# Altium schematic sheet MIXER.SchDoc (part 1 of 2)
size Letter; DrawnBy: Titan Yuan; SheetNumber: 3; SheetTotal: 8
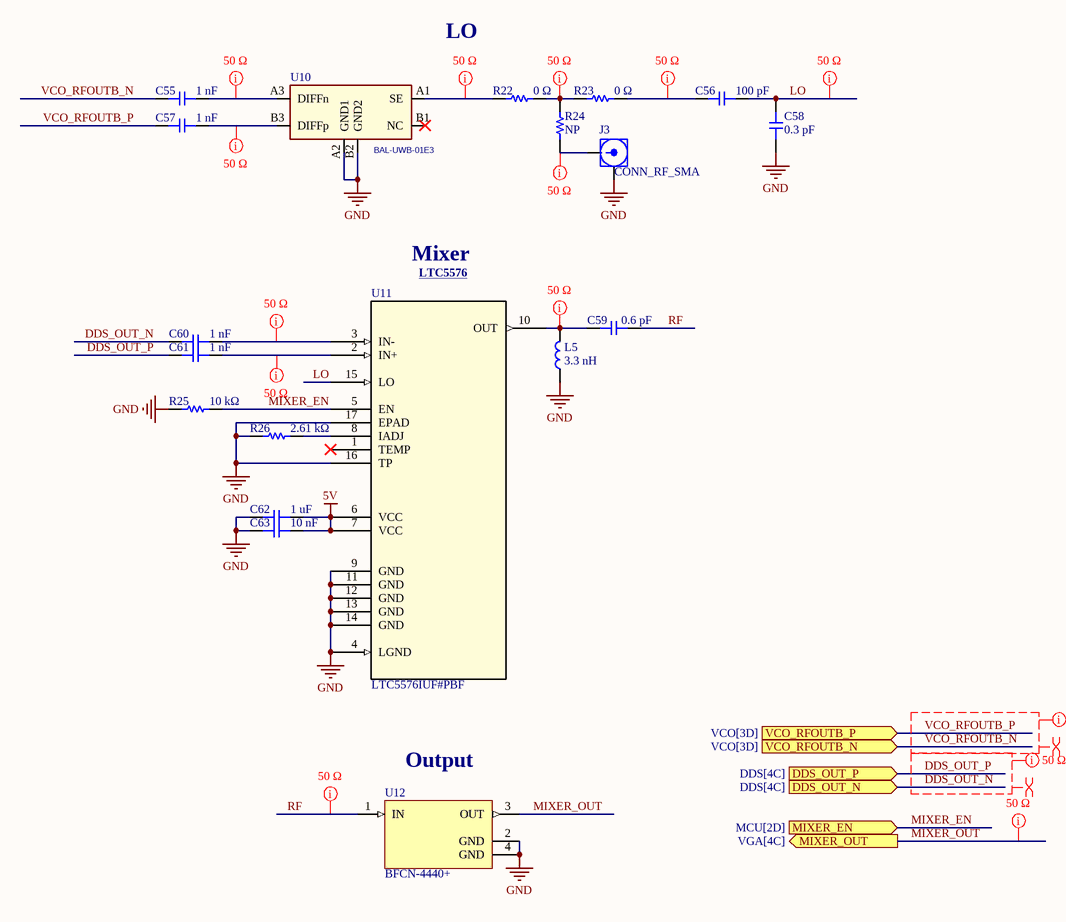
[diagram p0: MIXER.SchDoc]

## Parts
C55  1 nF  [CAP_0402]
C56  100 pF  [CAP_0402]
C57  1 nF  [CAP_0402]
C58  0.3 pF  [CAP_0402]
C59  0.6 pF  [CAP_0402]
C60  1 nF  [CAP_0402]
C61  1 nF  [CAP_0402]
C62  1 uF  [CAP_0603]
C63  10 nF  [CAP_0402]
J3  CONN_RF_SMA  [142-0701-801]
L5  3.3 nH  [IND_0402]
R22  0 Ω  [RES_0402]
R23  0 Ω  [RES_0402]
R24  NP  [RES_0402]
R25  10 kΩ  [RES_0402]
R26  2.61 kΩ  [RES_0402]
U10  BAL-UWB-01E3  [ST_CSP6_82x65P2x3_180x125x45]
U11  LTC5576IUF#PBF  [QFN-16_UF_LIT]
U12  BFCN-4440+  [FV1206]

## Ports
DDS_OUT_N (in, see DDS[4C]), DDS_OUT_P (in, see DDS[4C]), MIXER_EN (in, see MCU[2D]), MIXER_OUT (out, see VGA[4C]), VCO_RFOUTB_N (in, see VCO[3D]), VCO_RFOUTB_P (in, see VCO[3D])

## Nets
5V: C62.2 C63.2 U11.6(VCC) U11.7(VCC)
GND: C58.1 C62.1 C63.1 J3.2 L5.1 R25.1 R26.1 U10.A2(GND1) U10.B2(GND2) U11.4(LGND) U11.9(GND) U11.11(GND) U11.12(GND) U11.13(GND) U11.14(GND) U11.16(TP) U11.17(EPAD) U12.2(GND) U12.4(GND)
DDS_OUT_N: C60.1 ; port DDS_OUT_N
DDS_OUT_P: C61.1 ; port DDS_OUT_P
LO: C56.2 C58.2 U11.15(LO)
MIXER_EN: R25.2 U11.5(EN) ; port MIXER_EN
MIXER_OUT: U12.3(OUT) ; port MIXER_OUT
RF: C59.2 U12.1(IN)
VCO_RFOUTB_N: C55.2 ; port VCO_RFOUTB_N
VCO_RFOUTB_P: C57.2 ; port VCO_RFOUTB_P
NetC55_1: C55.1 U10.A3(DIFFn)
NetC56_1: C56.1 R23.2
NetC57_1: C57.1 U10.B3(DIFFp)
NetC59_1: C59.1 L5.2 U11.10(OUT)
NetC60_2: C60.2 U11.3(IN-)
NetC61_2: C61.2 U11.2(IN+)
NetJ3_1: J3.1 R24.1
NetR22_1: R22.1 U10.A1(SE)
NetR22_2: R22.2 R23.1 R24.2
NetR26_2: R26.2 U11.8(IADJ)

Not connected (* = marked no-connect by the designer): U10 B1(NC)*; U11 1(TEMP)*

## Layout directives
differential pair: DDS_OUT_N, DDS_OUT_P, VCO_RFOUTB_N, VCO_RFOUTB_P
net class 50 Ω: DDS_OUT_N, DDS_OUT_P, LO, MIXER_OUT, NetC55_1, NetC56_1, NetC57_1, NetC59_1, NetC60_2, NetC61_2, NetJ3_1, NetR22_1, NetR22_2, RF, VCO_RFOUTB_N, VCO_RFOUTB_P

## Notes on the sheet
- LO
- Mixer
- (near U11) LTC5576 <https://www.analog.com/en/products/ltc5576.html>
- (near U12) Output
## Library data of the parts
C55 C57 C60 C61 = CAP: 50V 1nF X7R ±10% 0402 Multilayer Ceramic Capacitors MLCC - SMD/SMT ROHS; Manufacturer: Yageo; Manufacturer Part Number: CC0402KRX7R9BB102; Tolerance: +-10%; Insulation Resistance: 100GΩ; Temperature Coefficient: 30ppm/°C; Voltage Rating: 50 V; Dielectric: Ceramic; Package Size: 0402; Supplier: DigiKey; Supplier Part Number: 311-1036-1-ND; RoHS: Compliant; Category: Ceramic Capacitors; Stock: 3090255; Pricing: 1=0.08, 10=0.004 (USD); Value: 1nF; Case/Package: 0402; Case Code (Imperial): 0402; Case Code (Metric): 1005; China RoHS: Compliant; Composition: Ceramic; Country of Origin: Mainland China, Taiwan; Depth: 500µm; Dielectric Material: Ceramic; Export Control Classification Number (ECCN) Code: EAR99; Halogen Free: Halogen Free; Height: 500µm; Harmonized Tariff Schedule (HTS) Code: 8532.24.00.20; Introduction Date: 2003-01-27; Lead Free: Lead Free; Length: 1mm; Lifecycle Status: Production; Material: Ceramic; Max Operating Temperature: 125°C; Min Operating Temperature: -55°C; Mounting Technology: Surface Mount; Pins: 2; Number of Terminals: 2; Radiation Hardening: No; REACH SVHC: Yes; Schedule B: 8532240020, 8532240020|8532240020|8532240020|8532240020|8532240020|8532240020|8532240020|8532240020|8532240020|8532240020|8532240020|8532240020|8532240020|8532240020|8532240020|8532240020|8532240020|8532240020|8532240020|8532240020|8532240020|8532240020|8532240020|85; Termination: SMD/SMT; Thickness: 558.8µm; Voltage: 50V; Voltage Rating (AC): 50V; Voltage Rating (DC): 50V; Width: 500µm; ComponentLink1URL: https://datasheet.octopart.com:443/CC0402KRX7R9BB102-Yageo-datasheet-177165144.pdf?src-supplier=IHS; ComponentLink1Description: https://datasheet.octopart.com:443/CC0402KRX7R9BB102-Yageo-datasheet-177165144.pdf?src-supplier=IHS; ComponentLink2URL: https://datasheet.octopart.com:443/CC0402KRX7R9BB102-Yageo-datasheet-82288757.pdf?src-supplier=Upverter; ComponentLink2Description: https://datasheet.octopart.com:443/CC0402KRX7R9BB102-Yageo-datasheet-82288757.pdf?src-supplier=Upverter; ComponentLink3URL: https://datasheet.octopart.com:443/CC0402KRX7R9BB102-Yageo-datasheet-78855684.pdf?src-supplier=Upverter; ComponentLink3Description: https://datasheet.octopart.com:443/CC0402KRX7R9BB102-Yageo-datasheet-78855684.pdf?src-supplier=Upverter; ComponentLink4URL: https://datasheet.octopart.com/CC0402KRX7R9BB102-Yageo-datasheet-10883670.pdf; ComponentLink4Description: https://datasheet.octopart.com/CC0402KRX7R9BB102-Yageo-datasheet-10883670.pdf; ComponentLink5URL: https://datasheet.octopart.com:443/CC0402KRX7R9BB102-Yageo-datasheet-147453679.pdf?src-supplier=Farnell; ComponentLink5Description: https://datasheet.octopart.com:443/CC0402KRX7R9BB102-Yageo-datasheet-147453679.pdf?src-supplier=Farnell; ComponentLink6URL: https://datasheet.octopart.com:443/CC0402KRX7R9BB102-Yageo-datasheet-151948686.pdf?src-supplier=Farnell; ComponentLink6Description: https://datasheet.octopart.com:443/CC0402KRX7R9BB102-Yageo-datasheet-151948686.pdf?src-supplier=Farnell; ComponentLink7URL: https://datasheet.octopart.com:443/CC0402KRX7R9BB102-Phycomp-datasheet-500777.pdf?src-supplier=Farnell; ComponentLink7Description: https://datasheet.octopart.com:443/CC0402KRX7R9BB102-Phycomp-datasheet-500777.pdf?src-supplier=Farnell; ComponentLink8URL: https://datasheet.octopart.com:443/CC0402KRX7R9BB102-Yageo-datasheet-5301394.pdf?src-supplier=Newark; ComponentLink8Description: https://datasheet.octopart.com:443/CC0402KRX7R9BB102-Yageo-datasheet-5301394.pdf?src-supplier=Newark; ComponentLink9URL: https://datasheet.octopart.com:443/CC0402KRX7R9BB102-Yageo-datasheet-62336348.pdf?src-supplier=Newark; ComponentLink9Description: https://datasheet.octopart.com:443/CC0402KRX7R9BB102-Yageo-datasheet-62336348.pdf?src-supplier=Newark; ComponentLink10URL: https://datasheet.octopart.com:443/CC0402KRX7R9BB102-Yageo-datasheet-182878162.pdf?src-supplier=Newark; ComponentLink10Description: https://datasheet.octopart.com:443/CC0402KRX7R9BB102-Yageo-datasheet-182878162.pdf?src-supplier=Newark; ComponentLink11URL: https://datasheet.octopart.com:443/CC0402KRX7R9BB102-Phycomp-datasheet-499490.pdf?src-supplier=element14; ComponentLink11Description: https://datasheet.octopart.com:443/CC0402KRX7R9BB102-Phycomp-datasheet-499490.pdf?src-supplier=element14; ComponentLink12URL: https://datasheet.octopart.com:443/CC0402KRX7R9BB102-Yageo-datasheet-8701427.pdf?src-supplier=element14; ComponentLink12Description: https://datasheet.octopart.com:443/CC0402KRX7R9BB102-Yageo-datasheet-8701427.pdf?src-supplier=element14; ComponentLink13URL: https://datasheet.octopart.com:443/CC0402KRX7R9BB102-Yageo-datasheet-166511530.pdf?src-supplier=Future+Electronics; ComponentLink13Description: https://datasheet.octopart.com:443/CC0402KRX7R9BB102-Yageo-datasheet-166511530.pdf?src-supplier=Future+Electronics; ComponentLink14URL: https://datasheet.octopart.com:443/CC0402KRX7R9BB102-Yageo-datasheet-137700082.pdf?src-supplier=Future+Electronics; ComponentLink14Description: https://datasheet.octopart.com:443/CC0402KRX7R9BB102-Yageo-datasheet-137700082.pdf?src-supplier=Future+Electronics; ComponentLink15URL: https://datasheet.octopart.com:443/CC0402KRX7R9BB102-Yageo-datasheet-137700084.pdf?src-supplier=Future+Electronics; ComponentLink15Description: https://datasheet.octopart.com:443/CC0402KRX7R9BB102-Yageo-datasheet-137700084.pdf?src-supplier=Future+Electronics; ComponentLink16URL: https://datasheet.octopart.com:443/CC0402KRX7R9BB102-Yageo-datasheet-78855685.pdf?src-supplier=Future+Electronics; ComponentLink16Description: https://datasheet.octopart.com:443/CC0402KRX7R9BB102-Yageo-datasheet-78855685.pdf?src-supplier=Future+Electronics; ComponentLink17URL: https://datasheet.octopart.com:443/CC0402KRX7R9BB102-Yageo-datasheet-27626582.pdf?src-supplier=Future+Electronics; ComponentLink17Description: https://datasheet.octopart.com:443/CC0402KRX7R9BB102-Yageo-datasheet-27626582.pdf?src-supplier=Future+Electronics; ComponentLink18URL: https://datasheet.octopart.com:443/CC0402KRX7R9BB102-Yageo-datasheet-24578986.pdf?src-supplier=Future+Electronics; ComponentLink18Description: https://datasheet.octopart.com:443/CC0402KRX7R9BB102-Yageo-datasheet-24578986.pdf?src-supplier=Future+Electronics; ComponentLink19URL: https://datasheet.octopart.com:443/CC0402KRX7R9BB102-Yageo-datasheet-15895757.pdf?src-supplier=Future+Electronics; ComponentLink19Description: https://datasheet.octopart.com:443/CC0402KRX7R9BB102-Yageo-datasheet-15895757.pdf?src-supplier=Future+Electronics; ComponentLink20URL: https://datasheet.octopart.com:443/CC0402KRX7R9BB102-Yageo-datasheet-12526321.pdf?src-supplier=Future+Electronics; ComponentLink20Description: https://datasheet.octopart.com:443/CC0402KRX7R9BB102-Yageo-datasheet-12526321.pdf?src-supplier=Future+Electronics; ComponentLink21URL: https://datasheet.octopart.com:443/CC0402KRX7R9BB102-Yageo-datasheet-8324192.pdf?src-supplier=Future+Electronics; ComponentLink21Description: https://datasheet.octopart.com:443/CC0402KRX7R9BB102-Yageo-datasheet-8324192.pdf?src-supplier=Future+Electronics; ComponentLink22URL: https://datasheet.octopart.com:443/CC0402KRX7R9BB102-Yageo-datasheet-68298032.pdf?src-supplier=Future+Electronics; ComponentLink22Description: https://datasheet.octopart.com:443/CC0402KRX7R9BB102-Yageo-datasheet-68298032.pdf?src-supplier=Future+Electronics; ComponentLink23URL: https://datasheet.octopart.com:443/CC0402KRX7R9BB102-Yageo-datasheet-178018854.pdf?src-supplier=Burklin+Elektronik; ComponentLink23Description: https://datasheet.octopart.com:443/CC0402KRX7R9BB102-Yageo-datasheet-178018854.pdf?src-supplier=Burklin+Elektronik; ComponentLink24URL: https://datasheet.octopart.com:443/CC0402KRX7R9BB102-Yageo-Group-datasheet-165992755.pdf?src-supplier=ODG+(Origin+Data+Global); ComponentLink24Description: https://datasheet.octopart.com:443/CC0402KRX7R9BB102-Yageo-Group-datasheet-165992755.pdf?src-supplier=ODG+(Origin+Data+Global); ComponentLink25URL: https://datasheet.octopart.com:443/CC0402KRX7R9BB102-Yageo-datasheet-120101875.pdf?src-supplier=Megastar; ComponentLink25Description: https://datasheet.octopart.com:443/CC0402KRX7R9BB102-Yageo-datasheet-120101875.pdf?src-supplier=Megastar; ComponentLink26URL: https://datasheet.octopart.com:443/CC0402KRX7R9BB102-Yageo-datasheet-118396.pdf?src-supplier=DigiKey; ComponentLink26Description: https://datasheet.octopart.com:443/CC0402KRX7R9BB102-Yageo-datasheet-118396.pdf?src-supplier=DigiKey; ComponentLink27URL: http://sigma.octopart.com:80/conflict_mineral_statement/Yageo-company-3.pdf?src-supplier=Compliance+Statements; ComponentLink27Description: http://sigma.octopart.com:80/conflict_mineral_statement/Yageo-company-3.pdf?src-supplier=Compliance+Statements; ComponentLink28URL: http://sigma.octopart.com:80/rohs_statement/Yageo-company-2.pdf?src-supplier=Compliance+Statements; ComponentLink28Description: http://sigma.octopart.com:80/rohs_statement/Yageo-company-2.pdf?src-supplier=Compliance+Statements
C56 = CAP: 50V 100pF NP0 ±5% 0402 Multilayer Ceramic Capacitors MLCC - SMD/SMT ROHS; Manufacturer: Yageo; Manufacturer Part Number: CC0402JRNPO9BN101; Tolerance: +-5%; Insulation Resistance: 100GΩ; Temperature Coefficient: 30ppm/°C; Voltage Rating: 50 V; Dielectric: Ceramic; Package Size: 0402; Supplier: DigiKey; Supplier Part Number: 311-1024-1-ND; RoHS: Compliant; Category: Ceramic Capacitors; Stock: 3080901; Pricing: 1=0.08, 10=0.003, 10000=0.0032, 20000=0.0031, 30000=0.00304, 50000=0.00283, 70000=0.00282 (USD); Value: 100pF; Case/Package: 0402; Case Code (Imperial): 0402; Case Code (Metric): 1005; China RoHS: Compliant; Composition: Ceramic; Depth: 500µm; Dielectric Material: Ceramic; Halogen Free: Halogen Free; Height: 500µm; Lead Free: Lead Free; Length: 1mm; Lifecycle Status: Production; Max Operating Temperature: 125°C; Min Operating Temperature: -55°C; Mounting Technology: Surface Mount; Pins: 2; Number of Terminals: 2; Radiation Hardening: No; REACH SVHC: Yes; Schedule B: 8532240020, 8532240020|8532240020|8532240020|8532240020|8532240020|8532240020|8532240020|8532240020|8532240020|8532240020|8532240020|8532240020|8532240020|8532240020|8532240020|8532240020|8532240020|8532240020|8532240020|8532240020|8532240020|8532240020|8532240020|85; Termination: SMD/SMT; Thickness: 558.8µm; Voltage: 50V; Voltage Rating (AC): 50V; Voltage Rating (DC): 50V; Width: 500µm; ComponentLink1URL: https://datasheet.octopart.com:443/CC0402JRNPO9BN101-Yageo-datasheet-182140217.pdf?src-supplier=IHS; ComponentLink1Description: https://datasheet.octopart.com:443/CC0402JRNPO9BN101-Yageo-datasheet-182140217.pdf?src-supplier=IHS; ComponentLink2URL: https://datasheet.octopart.com:443/CC0402JRNPO9BN101-Yageo-datasheet-10406438.pdf?src-supplier=element14+APAC; ComponentLink2Description: https://datasheet.octopart.com:443/CC0402JRNPO9BN101-Yageo-datasheet-10406438.pdf?src-supplier=element14+APAC; ComponentLink3URL: https://datasheet.octopart.com:443/CC0402JRNPO9BN101-Yageo-datasheet-151948684.pdf?src-supplier=element14+APAC; ComponentLink3Description: https://datasheet.octopart.com:443/CC0402JRNPO9BN101-Yageo-datasheet-151948684.pdf?src-supplier=element14+APAC; ComponentLink4URL: https://datasheet.octopart.com:443/CC0402JRNPO9BN101-Yageo-datasheet-67645495.pdf?src-supplier=element14+APAC; ComponentLink4Description: https://datasheet.octopart.com:443/CC0402JRNPO9BN101-Yageo-datasheet-67645495.pdf?src-supplier=element14+APAC; ComponentLink5URL: https://datasheet.octopart.com:443/CC0402JRNPO9BN101-Yageo-datasheet-10882999.pdf?src-supplier=element14+APAC; ComponentLink5Description: https://datasheet.octopart.com:443/CC0402JRNPO9BN101-Yageo-datasheet-10882999.pdf?src-supplier=element14+APAC; ComponentLink6URL: https://datasheet.octopart.com:443/CC0402JRNPO9BN101-Yageo-datasheet-78855684.pdf?src-supplier=Upverter; ComponentLink6Description: https://datasheet.octopart.com:443/CC0402JRNPO9BN101-Yageo-datasheet-78855684.pdf?src-supplier=Upverter; ComponentLink7URL: https://datasheet.octopart.com:443/CC0402JRNPO9BN101-Yageo-Group-datasheet-188689597.pdf?src-supplier=Farnell; ComponentLink7Description: https://datasheet.octopart.com:443/CC0402JRNPO9BN101-Yageo-Group-datasheet-188689597.pdf?src-supplier=Farnell; ComponentLink8URL: https://datasheet.octopart.com:443/CC0402JRNPO9BN101-Yageo-datasheet-10621397.pdf?src-supplier=Farnell; ComponentLink8Description: https://datasheet.octopart.com:443/CC0402JRNPO9BN101-Yageo-datasheet-10621397.pdf?src-supplier=Farnell; ComponentLink9URL: https://datasheet.octopart.com:443/CC0402JRNPO9BN101-Yageo-datasheet-65873193.pdf?src-supplier=Newark; ComponentLink9Description: https://datasheet.octopart.com:443/CC0402JRNPO9BN101-Yageo-datasheet-65873193.pdf?src-supplier=Newark; ComponentLink10URL: https://datasheet.octopart.com:443/CC0402JRNPO9BN101-Yageo-datasheet-5301394.pdf?src-supplier=Newark; ComponentLink10Description: https://datasheet.octopart.com:443/CC0402JRNPO9BN101-Yageo-datasheet-5301394.pdf?src-supplier=Newark; ComponentLink11URL: https://datasheet.octopart.com:443/CC0402JRNPO9BN101-Yageo-datasheet-182966517.pdf?src-supplier=Newark; ComponentLink11Description: https://datasheet.octopart.com:443/CC0402JRNPO9BN101-Yageo-datasheet-182966517.pdf?src-supplier=Newark; ComponentLink12URL: https://datasheet.octopart.com:443/CC0402JRNPO9BN101-Yageo-datasheet-137875056.pdf?src-supplier=Future+Electronics; ComponentLink12Description: https://datasheet.octopart.com:443/CC0402JRNPO9BN101-Yageo-datasheet-137875056.pdf?src-supplier=Future+Electronics; ComponentLink13URL: https://datasheet.octopart.com:443/CC0402JRNPO9BN101-Yageo-datasheet-136957424.pdf?src-supplier=Future+Electronics; ComponentLink13Description: https://datasheet.octopart.com:443/CC0402JRNPO9BN101-Yageo-datasheet-136957424.pdf?src-supplier=Future+Electronics; ComponentLink14URL: https://datasheet.octopart.com:443/CC0402JRNPO9BN101-Yageo-datasheet-137700082.pdf?src-supplier=Future+Electronics; ComponentLink14Description: https://datasheet.octopart.com:443/CC0402JRNPO9BN101-Yageo-datasheet-137700082.pdf?src-supplier=Future+Electronics; ComponentLink15URL: https://datasheet.octopart.com:443/CC0402JRNPO9BN101-Yageo-datasheet-62126864.pdf?src-supplier=Future+Electronics; ComponentLink15Description: https://datasheet.octopart.com:443/CC0402JRNPO9BN101-Yageo-datasheet-62126864.pdf?src-supplier=Future+Electronics; ComponentLink16URL: https://datasheet.octopart.com:443/CC0402JRNPO9BN101-Yageo-datasheet-62091628.pdf?src-supplier=Future+Electronics; ComponentLink16Description: https://datasheet.octopart.com:443/CC0402JRNPO9BN101-Yageo-datasheet-62091628.pdf?src-supplier=Future+Electronics; ComponentLink17URL: https://datasheet.octopart.com:443/CC0402JRNPO9BN101-Yageo-datasheet-24578986.pdf?src-supplier=Future+Electronics; ComponentLink17Description: https://datasheet.octopart.com:443/CC0402JRNPO9BN101-Yageo-datasheet-24578986.pdf?src-supplier=Future+Electronics; ComponentLink18URL: https://datasheet.octopart.com:443/CC0402JRNPO9BN101-Yageo-datasheet-16730043.pdf?src-supplier=Future+Electronics; ComponentLink18Description: https://datasheet.octopart.com:443/CC0402JRNPO9BN101-Yageo-datasheet-16730043.pdf?src-supplier=Future+Electronics; ComponentLink19URL: https://datasheet.octopart.com:443/CC0402JRNPO9BN101-Yageo-datasheet-12589826.pdf?src-supplier=Future+Electronics; ComponentLink19Description: https://datasheet.octopart.com:443/CC0402JRNPO9BN101-Yageo-datasheet-12589826.pdf?src-supplier=Future+Electronics; ComponentLink20URL: https://datasheet.octopart.com:443/CC0402JRNPO9BN101-Yageo-datasheet-8817079.pdf?src-supplier=element14; ComponentLink20Description: https://datasheet.octopart.com:443/CC0402JRNPO9BN101-Yageo-datasheet-8817079.pdf?src-supplier=element14; ComponentLink21URL: https://datasheet.octopart.com:443/CC0402JRNPO9BN101-Yageo-datasheet-8324240.pdf?src-supplier=element14; ComponentLink21Description: https://datasheet.octopart.com:443/CC0402JRNPO9BN101-Yageo-datasheet-8324240.pdf?src-supplier=element14; ComponentLink22URL: https://datasheet.octopart.com:443/CC0402JRNPO9BN101-Yageo-datasheet-504625.pdf?src-supplier=element14; ComponentLink22Description: https://datasheet.octopart.com:443/CC0402JRNPO9BN101-Yageo-datasheet-504625.pdf?src-supplier=element14; ComponentLink23URL: https://datasheet.octopart.com:443/CC0402JRNPO9BN101-Yageo-datasheet-5321569.pdf?src-supplier=element14; ComponentLink23Description: https://datasheet.octopart.com:443/CC0402JRNPO9BN101-Yageo-datasheet-5321569.pdf?src-supplier=element14; ComponentLink24URL: https://datasheet.octopart.com:443/CC0402JRNPO9BN101-Yageo-datasheet-68296204.pdf?src-supplier=Megastar; ComponentLink24Description: https://datasheet.octopart.com:443/CC0402JRNPO9BN101-Yageo-datasheet-68296204.pdf?src-supplier=Megastar; ComponentLink25URL: http://sigma.octopart.com:80/conflict_mineral_statement/Yageo-company-3.pdf?src-supplier=Compliance+Statements; ComponentLink25Description: http://sigma.octopart.com:80/conflict_mineral_statement/Yageo-company-3.pdf?src-supplier=Compliance+Statements; ComponentLink26URL: http://sigma.octopart.com:80/rohs_statement/Yageo-company-2.pdf?src-supplier=Compliance+Statements; ComponentLink26Description: http://sigma.octopart.com:80/rohs_statement/Yageo-company-2.pdf?src-supplier=Compliance+Statements
C58 = CAP: 50V 0.3pF C0G 0402 Multilayer Ceramic Capacitors MLCC - SMD/SMT ROHS; Manufacturer: Murata Electronics; Manufacturer Part Number: GJM1555C1HR30WB01D; Manufacturer Lifecycle Status: IN PRODUCTION; Tolerance: +-0.05 pF; Value: 300fF; Temperature Coefficient: 30ppm/°C; Voltage Rating: 50 V; Dielectric: Ceramic; Package Size: 0402; Dielectric Material: Ceramic; Supplier: DigiKey; Supplier Part Number: 490-11248-1-ND; RoHS: Compliant; Category: Ceramic Capacitors; Stock: 220310; Pricing: 1=0.14, 10=0.076, 50=0.0532, 100=0.0462, 500=0.0344, 1000=0.03078, 2500=0.02696, 5000=0.02467 (USD); Case/Package: 0402; Case Code (Imperial): 0402; Case Code (Metric): 1005; Depth: 500µm; Export Control Classification Number (ECCN) Code: EAR99; Height: 500µm; Harmonized Tariff Schedule (HTS) Code: 8532.24.00.20; Introduction Date: 2008-02-22; Lead Free: Lead Free; Length: 1mm; Lifecycle Status: Production; Material: Ceramic; Max Operating Temperature: 125°C; Min Operating Temperature: -55°C; Mounting Technology: Surface Mount; Number of Terminals: 2; Radiation Hardening: No; REACH SVHC: Yes; Schedule B: 8532240020, 8532240020|8532240020, 8532240020|8532240020|8532240020, 8532240020|8532240020|8532240020|8532240020; Termination: SMD/SMT; Thickness: 500µm; Voltage Rating (DC): 50V; Width: 500µm; ComponentLink1URL: https://datasheet.octopart.com:443/GJM1555C1HR30WB01D-Murata-datasheet-96711512.pdf?src-supplier=element14+APAC; ComponentLink1Description: https://datasheet.octopart.com:443/GJM1555C1HR30WB01D-Murata-datasheet-96711512.pdf?src-supplier=element14+APAC; ComponentLink2URL: https://datasheet.octopart.com:443/GJM1555C1HR30WB01D-Murata-datasheet-141271466.pdf?src-supplier=Geoflip; ComponentLink2Description: https://datasheet.octopart.com:443/GJM1555C1HR30WB01D-Murata-datasheet-141271466.pdf?src-supplier=Geoflip; ComponentLink3URL: https://datasheet.octopart.com:443/GJM1555C1HR30WB01D-Murata-datasheet-165579666.pdf?src-supplier=TME; ComponentLink3Description: https://datasheet.octopart.com:443/GJM1555C1HR30WB01D-Murata-datasheet-165579666.pdf?src-supplier=TME; ComponentLink4URL: https://datasheet.octopart.com:443/GJM1555C1HR30WB01D-Murata-datasheet-12511495.pdf?src-supplier=TME; ComponentLink4Description: https://datasheet.octopart.com:443/GJM1555C1HR30WB01D-Murata-datasheet-12511495.pdf?src-supplier=TME; ComponentLink5URL: https://datasheet.octopart.com:443/GJM1555C1HR30WB01D-Murata-datasheet-140665803.pdf?src-supplier=Ciiva; ComponentLink5Description: https://datasheet.octopart.com:443/GJM1555C1HR30WB01D-Murata-datasheet-140665803.pdf?src-supplier=Ciiva; ComponentLink6URL: https://datasheet.octopart.com:443/GJM1555C1HR30WB01D-Murata-datasheet-138725173.pdf?src-supplier=Ciiva; ComponentLink6Description: https://datasheet.octopart.com:443/GJM1555C1HR30WB01D-Murata-datasheet-138725173.pdf?src-supplier=Ciiva; ComponentLink7URL: https://datasheet.octopart.com:443/GJM1555C1HR30WB01D-Murata-datasheet-22122223.pdf?src-supplier=Future+Electronics; ComponentLink7Description: https://datasheet.octopart.com:443/GJM1555C1HR30WB01D-Murata-datasheet-22122223.pdf?src-supplier=Future+Electronics; ComponentLink8URL: https://datasheet.octopart.com:443/GJM1555C1HR30WB01D-Murata-datasheet-12510170.pdf?src-supplier=Future+Electronics; ComponentLink8Description: https://datasheet.octopart.com:443/GJM1555C1HR30WB01D-Murata-datasheet-12510170.pdf?src-supplier=Future+Electronics; ComponentLink9URL: https://datasheet.octopart.com:443/GJM1555C1HR30WB01D-Murata-datasheet-8517407.pdf?src-supplier=Future+Electronics; ComponentLink9Description: https://datasheet.octopart.com:443/GJM1555C1HR30WB01D-Murata-datasheet-8517407.pdf?src-supplier=Future+Electronics; ComponentLink10URL: https://datasheet.octopart.com:443/GJM1555C1HR30WB01D-Murata-datasheet-8387045.pdf?src-supplier=Future+Electronics; ComponentLink10Description: https://datasheet.octopart.com:443/GJM1555C1HR30WB01D-Murata-datasheet-8387045.pdf?src-supplier=Future+Electronics; ComponentLink11URL: https://datasheet.octopart.com:443/GJM1555C1HR30WB01D-Murata-datasheet-8324201.pdf?src-supplier=Future+Electronics; ComponentLink11Description: https://datasheet.octopart.com:443/GJM1555C1HR30WB01D-Murata-datasheet-8324201.pdf?src-supplier=Future+Electronics; ComponentLink12URL: https://datasheet.octopart.com:443/GJM1555C1HR30WB01D-Murata-datasheet-7628724.pdf?src-supplier=Future+Electronics; ComponentLink12Description: https://datasheet.octopart.com:443/GJM1555C1HR30WB01D-Murata-datasheet-7628724.pdf?src-supplier=Future+Electronics; ComponentLink13URL: https://datasheet.octopart.com:443/GJM1555C1HR30WB01D-Murata-datasheet-552801.pdf?src-supplier=Future+Electronics; ComponentLink13Description: https://datasheet.octopart.com:443/GJM1555C1HR30WB01D-Murata-datasheet-552801.pdf?src-supplier=Future+Electronics; ComponentLink14URL: https://datasheet.octopart.com:443/GJM1555C1HR30WB01D-Murata-datasheet-566194.pdf?src-supplier=Future+Electronics; ComponentLink14Description: https://datasheet.octopart.com:443/GJM1555C1HR30WB01D-Murata-datasheet-566194.pdf?src-supplier=Future+Electronics; ComponentLink15URL: https://datasheet.octopart.com:443/GJM1555C1HR30WB01D-Murata-datasheet-44781310.pdf?src-supplier=Future+Electronics; ComponentLink15Description: https://datasheet.octopart.com:443/GJM1555C1HR30WB01D-Murata-datasheet-44781310.pdf?src-supplier=Future+Electronics; ComponentLink16URL: https://datasheet.octopart.com/GJM1555C1HR30WB01D-Murata-datasheet-12515295.pdf; ComponentLink16Description: https://datasheet.octopart.com/GJM1555C1HR30WB01D-Murata-datasheet-12515295.pdf; ComponentLink17URL: https://datasheet.octopart.com/GJM1555C1HR30WB01D-Murata-datasheet-12510076.pdf; ComponentLink17Description: https://datasheet.octopart.com/GJM1555C1HR30WB01D-Murata-datasheet-12510076.pdf; ComponentLink18URL: https://datasheet.octopart.com/GJM1555C1HR30WB01D-Murata-datasheet-11978611.pdf; ComponentLink18Description: https://datasheet.octopart.com/GJM1555C1HR30WB01D-Murata-datasheet-11978611.pdf; ComponentLink19URL: https://datasheet.octopart.com/GJM1555C1HR30WB01D-Murata-datasheet-10025737.pdf; ComponentLink19Description: https://datasheet.octopart.com/GJM1555C1HR30WB01D-Murata-datasheet-10025737.pdf; ComponentLink20URL: https://datasheet.octopart.com/GJM1555C1HR30WB01D-Murata-datasheet-8819587.pdf; ComponentLink20Description: https://datasheet.octopart.com/GJM1555C1HR30WB01D-Murata-datasheet-8819587.pdf; ComponentLink21URL: https://datasheet.octopart.com/GJM1555C1HR30WB01D-Murata-datasheet-14406296.pdf; ComponentLink21Description: https://datasheet.octopart.com/GJM1555C1HR30WB01D-Murata-datasheet-14406296.pdf; ComponentLink22URL: http://sigma.octopart.com:80/reach_statement/Murata-company-16.pdf?src-supplier=Compliance+Statements; ComponentLink22Description: http://sigma.octopart.com:80/reach_statement/Murata-company-16.pdf?src-supplier=Compliance+Statements
C59 = CAP: 50V 0.6pF C0G 0402 Multilayer Ceramic Capacitors MLCC - SMD/SMT ROHS; Manufacturer: Murata Electronics; Manufacturer Part Number: GJM1555C1HR60WB01D; Manufacturer Lifecycle Status: IN PRODUCTION; Tolerance: +-0.05 pF; Value: 600fF; Temperature Coefficient: 30ppm/°C; Voltage Rating: 50 V; Dielectric: Ceramic; Package Size: 0402; Supplier: DigiKey; Supplier Part Number: 490-11251-1-ND; RoHS: Compliant; Category: Ceramic Capacitors; Stock: 2729; Pricing: 1=0.14, 10=0.078, 50=0.0548, 100=0.0475, 500=0.03538 (USD); Case/Package: 0402; Case Code (Imperial): 0402; Case Code (Metric): 1005; Depth: 500µm; Dielectric Material: Ceramic; Export Control Classification Number (ECCN) Code: EAR99; Height: 500µm; Harmonized Tariff Schedule (HTS) Code: 8532.24.00.20; Introduction Date: 2008-02-22; Lead Free: Lead Free; Length: 1mm; Lifecycle Status: Production; Material: Ceramic; Max Operating Temperature: 125°C; Min Operating Temperature: -55°C; Mounting Technology: Surface Mount; Number of Terminals: 2; Radiation Hardening: No; REACH SVHC: Yes; Schedule B: 8532240020, 8532240020|8532240020, 8532240020|8532240020|8532240020, 8532240020|8532240020|8532240020|8532240020; Termination: SMD/SMT; Thickness: 500µm; Voltage Rating (DC): 50V; Weight: 652.039032µg; Width: 500µm; ComponentLink1URL: https://datasheet.octopart.com:443/GJM1555C1HR60WB01D-Murata-datasheet-512327.pdf?src-supplier=_legacy+Avnet; ComponentLink1Description: https://datasheet.octopart.com:443/GJM1555C1HR60WB01D-Murata-datasheet-512327.pdf?src-supplier=_legacy+Avnet; ComponentLink2URL: https://datasheet.octopart.com:443/GJM1555C1HR60WB01D-Murata-datasheet-165579666.pdf?src-supplier=TME; ComponentLink2Description: https://datasheet.octopart.com:443/GJM1555C1HR60WB01D-Murata-datasheet-165579666.pdf?src-supplier=TME; ComponentLink3URL: https://datasheet.octopart.com:443/GJM1555C1HR60WB01D-Murata-datasheet-12511495.pdf?src-supplier=TME; ComponentLink3Description: https://datasheet.octopart.com:443/GJM1555C1HR60WB01D-Murata-datasheet-12511495.pdf?src-supplier=TME; ComponentLink4URL: https://datasheet.octopart.com:443/GJM1555C1HR60WB01D-Murata-datasheet-141271479.pdf?src-supplier=Ciiva; ComponentLink4Description: https://datasheet.octopart.com:443/GJM1555C1HR60WB01D-Murata-datasheet-141271479.pdf?src-supplier=Ciiva; ComponentLink5URL: https://datasheet.octopart.com:443/GJM1555C1HR60WB01D-Murata-datasheet-140665840.pdf?src-supplier=Ciiva; ComponentLink5Description: https://datasheet.octopart.com:443/GJM1555C1HR60WB01D-Murata-datasheet-140665840.pdf?src-supplier=Ciiva; ComponentLink6URL: https://datasheet.octopart.com:443/GJM1555C1HR60WB01D-Murata-datasheet-138725218.pdf?src-supplier=Ciiva; ComponentLink6Description: https://datasheet.octopart.com:443/GJM1555C1HR60WB01D-Murata-datasheet-138725218.pdf?src-supplier=Ciiva; ComponentLink7URL: https://datasheet.octopart.com:443/GJM1555C1HR60WB01D-Murata-datasheet-192320398.pdf?src-supplier=HQonline; ComponentLink7Description: https://datasheet.octopart.com:443/GJM1555C1HR60WB01D-Murata-datasheet-192320398.pdf?src-supplier=HQonline; ComponentLink8URL: https://datasheet.octopart.com:443/GJM1555C1HR60WB01D-Murata-datasheet-22122223.pdf?src-supplier=Future+Electronics; ComponentLink8Description: https://datasheet.octopart.com:443/GJM1555C1HR60WB01D-Murata-datasheet-22122223.pdf?src-supplier=Future+Electronics; ComponentLink9URL: https://datasheet.octopart.com:443/GJM1555C1HR60WB01D-Murata-datasheet-12510170.pdf?src-supplier=Future+Electronics; ComponentLink9Description: https://datasheet.octopart.com:443/GJM1555C1HR60WB01D-Murata-datasheet-12510170.pdf?src-supplier=Future+Electronics; ComponentLink10URL: https://datasheet.octopart.com:443/GJM1555C1HR60WB01D-Murata-datasheet-8517407.pdf?src-supplier=Future+Electronics; ComponentLink10Description: https://datasheet.octopart.com:443/GJM1555C1HR60WB01D-Murata-datasheet-8517407.pdf?src-supplier=Future+Electronics; ComponentLink11URL: https://datasheet.octopart.com:443/GJM1555C1HR60WB01D-Murata-datasheet-8387045.pdf?src-supplier=Future+Electronics; ComponentLink11Description: https://datasheet.octopart.com:443/GJM1555C1HR60WB01D-Murata-datasheet-8387045.pdf?src-supplier=Future+Electronics; ComponentLink12URL: https://datasheet.octopart.com:443/GJM1555C1HR60WB01D-Murata-datasheet-8324201.pdf?src-supplier=Future+Electronics; ComponentLink12Description: https://datasheet.octopart.com:443/GJM1555C1HR60WB01D-Murata-datasheet-8324201.pdf?src-supplier=Future+Electronics; ComponentLink13URL: https://datasheet.octopart.com:443/GJM1555C1HR60WB01D-Murata-datasheet-7628724.pdf?src-supplier=Future+Electronics; ComponentLink13Description: https://datasheet.octopart.com:443/GJM1555C1HR60WB01D-Murata-datasheet-7628724.pdf?src-supplier=Future+Electronics; ComponentLink14URL: https://datasheet.octopart.com:443/GJM1555C1HR60WB01D-Murata-datasheet-552801.pdf?src-supplier=Future+Electronics; ComponentLink14Description: https://datasheet.octopart.com:443/GJM1555C1HR60WB01D-Murata-datasheet-552801.pdf?src-supplier=Future+Electronics; ComponentLink15URL: https://datasheet.octopart.com:443/GJM1555C1HR60WB01D-Murata-datasheet-44781338.pdf?src-supplier=Future+Electronics; ComponentLink15Description: https://datasheet.octopart.com:443/GJM1555C1HR60WB01D-Murata-datasheet-44781338.pdf?src-supplier=Future+Electronics; ComponentLink16URL: https://datasheet.octopart.com/GJM1555C1HR60WB01D-Murata-datasheet-12515295.pdf; ComponentLink16Description: https://datasheet.octopart.com/GJM1555C1HR60WB01D-Murata-datasheet-12515295.pdf; ComponentLink17URL: https://datasheet.octopart.com/GJM1555C1HR60WB01D-Murata-datasheet-12510076.pdf; ComponentLink17Description: https://datasheet.octopart.com/GJM1555C1HR60WB01D-Murata-datasheet-12510076.pdf; ComponentLink18URL: https://datasheet.octopart.com/GJM1555C1HR60WB01D-Murata-datasheet-11978611.pdf; ComponentLink18Description: https://datasheet.octopart.com/GJM1555C1HR60WB01D-Murata-datasheet-11978611.pdf; ComponentLink19URL: https://datasheet.octopart.com/GJM1555C1HR60WB01D-Murata-datasheet-10025737.pdf; ComponentLink19Description: https://datasheet.octopart.com/GJM1555C1HR60WB01D-Murata-datasheet-10025737.pdf; ComponentLink20URL: https://datasheet.octopart.com/GJM1555C1HR60WB01D-Murata-datasheet-8819587.pdf; ComponentLink20Description: https://datasheet.octopart.com/GJM1555C1HR60WB01D-Murata-datasheet-8819587.pdf; ComponentLink21URL: https://datasheet.octopart.com/GJM1555C1HR60WB01D-Murata-datasheet-14406307.pdf; ComponentLink21Description: https://datasheet.octopart.com/GJM1555C1HR60WB01D-Murata-datasheet-14406307.pdf; ComponentLink22URL: http://sigma.octopart.com:80/reach_statement/Murata-company-16.pdf?src-supplier=Compliance+Statements; ComponentLink22Description: http://sigma.octopart.com:80/reach_statement/Murata-company-16.pdf?src-supplier=Compliance+Statements
C62 = CAP: 25V 1uF X7R ±10% 0603 Multilayer Ceramic Capacitors MLCC - SMD/SMT ROHS; Manufacturer: Samsung Electro-Mechanics; Manufacturer Part Number: CL10B105KA8NNNC; Tolerance: +-10%; Value: 1µF; Voltage Rating: 25 V; Dielectric: Ceramic; Package Size: 0603; Supplier: DigiKey; Supplier Part Number: 1276-1184-1-ND; RoHS: Compliant; Category: Ceramic Capacitors; Stock: 1060664; Pricing: 1=0.1, 10=0.036, 50=0.0244, 100=0.0208, 500=0.01486, 1000=0.01305 (USD); Case/Package: 0603; Case Code (Imperial): 0603; Case Code (Metric): 1608; China RoHS: Compliant; Contact Plating: Tin; Country of Origin: Mainland China, Philippines, South Korea; Depth: 800µm; Dielectric Material: Ceramic; Export Control Classification Number (ECCN) Code: EAR99; Height: 900µm; Harmonized Tariff Schedule (HTS) Code: 8532.24.00.20; Introduction Date: 2009-11-02; Length: 1.6mm; Lifecycle Status: Production; Material: Ceramic; Max Operating Temperature: 125°C; Min Operating Temperature: -55°C; Mounting Technology: Surface Mount; Number of Terminals: 2; Radiation Hardening: No; REACH SVHC: Yes; Schedule B: 8532240020, 8532240020|8532240020, 8532240020|8532240020|8532240020, 8532240020|8532240020|8532240020|8532240020; Thickness: 889µm; Voltage: 25V; Voltage Rating (DC): 25V; Width: 800µm; ComponentLink1URL: https://datasheet.octopart.com:443/CL10B105KA8NNNC-Samsung-Electro-Mechanics-datasheet-182019882.pdf?src-supplier=IHS; ComponentLink1Description: https://datasheet.octopart.com:443/CL10B105KA8NNNC-Samsung-Electro-Mechanics-datasheet-182019882.pdf?src-supplier=IHS; ComponentLink2URL: https://datasheet.octopart.com:443/CL10B105KA8NNNC-Samsung-Electro-Mechanics-datasheet-106547815.pdf?src-supplier=Upverter; ComponentLink2Description: https://datasheet.octopart.com:443/CL10B105KA8NNNC-Samsung-Electro-Mechanics-datasheet-106547815.pdf?src-supplier=Upverter; ComponentLink3URL: https://datasheet.octopart.com:443/CL10B105KA8NNNC-Samsung-Electro-Mechanics-datasheet-137699931.pdf?src-supplier=Samsung+SCT; ComponentLink3Description: https://datasheet.octopart.com:443/CL10B105KA8NNNC-Samsung-Electro-Mechanics-datasheet-137699931.pdf?src-supplier=Samsung+SCT; ComponentLink4URL: https://datasheet.octopart.com:443/CL10B105KA8NNNC-Samsung-Electro-Mechanics-datasheet-116890983.pdf?src-supplier=Future+Electronics; ComponentLink4Description: https://datasheet.octopart.com:443/CL10B105KA8NNNC-Samsung-Electro-Mechanics-datasheet-116890983.pdf?src-supplier=Future+Electronics; ComponentLink5URL: https://datasheet.octopart.com:443/CL10B105KA8NNNC-Samsung-datasheet-12527851.pdf?src-supplier=Future+Electronics; ComponentLink5Description: https://datasheet.octopart.com:443/CL10B105KA8NNNC-Samsung-datasheet-12527851.pdf?src-supplier=Future+Electronics; ComponentLink6URL: https://datasheet.octopart.com:443/CL10B105KA8NNNC-Samsung-datasheet-26669022.pdf?src-supplier=Future+Electronics; ComponentLink6Description: https://datasheet.octopart.com:443/CL10B105KA8NNNC-Samsung-datasheet-26669022.pdf?src-supplier=Future+Electronics; ComponentLink7URL: https://datasheet.octopart.com:443/CL10B105KA8NNNC-Samsung-Electro-Mechanics-datasheet-149136795.pdf?src-supplier=Future+Electronics; ComponentLink7Description: https://datasheet.octopart.com:443/CL10B105KA8NNNC-Samsung-Electro-Mechanics-datasheet-149136795.pdf?src-supplier=Future+Electronics; ComponentLink8URL: https://datasheet.octopart.com:443/CL10B105KA8NNNC-Samsung-datasheet-37081328.pdf?src-supplier=Future+Electronics; ComponentLink8Description: https://datasheet.octopart.com:443/CL10B105KA8NNNC-Samsung-datasheet-37081328.pdf?src-supplier=Future+Electronics; ComponentLink9URL: https://datasheet.octopart.com/CL10B105KA8NNNC-Samsung-Electro-Mechanics-datasheet-97040617.pdf; ComponentLink9Description: https://datasheet.octopart.com/CL10B105KA8NNNC-Samsung-Electro-Mechanics-datasheet-97040617.pdf; ComponentLink10URL: https://datasheet.octopart.com/CL10B105KA8NNNC-Samsung-Electro-Mechanics-datasheet-8324245.pdf; ComponentLink10Description: https://datasheet.octopart.com/CL10B105KA8NNNC-Samsung-Electro-Mechanics-datasheet-8324245.pdf; ComponentLink11URL: https://datasheet.octopart.com:443/CL10B105KA8NNNC-Samsung-datasheet-59220082.pdf?src-supplier=TME; ComponentLink11Description: https://datasheet.octopart.com:443/CL10B105KA8NNNC-Samsung-datasheet-59220082.pdf?src-supplier=TME; ComponentLink12URL: https://datasheet.octopart.com:443/CL10B105KA8NNNC-Samsung-Electro-Mechanics-datasheet-11897796.pdf?src-supplier=Arrow+Electronics; ComponentLink12Description: https://datasheet.octopart.com:443/CL10B105KA8NNNC-Samsung-Electro-Mechanics-datasheet-11897796.pdf?src-supplier=Arrow+Electronics
C63 = CAP: 50V 10nF X7R ±10% 0402 Multilayer Ceramic Capacitors MLCC - SMD/SMT ROHS; Manufacturer: Yageo; Manufacturer Part Number: CC0402KRX7R9BB103; Tolerance: +-10%; Temperature Coefficient: 30ppm/°C; Voltage Rating: 50 V; Dielectric: Ceramic; Package Size: 0402; Supplier: DigiKey; Supplier Part Number: 311-1349-1-ND; RoHS: Compliant; Category: Ceramic Capacitors; Stock: 2286845; Pricing: 1=0.08, 10=0.003 (USD); Value: 10nF; Case/Package: 0402; Case Code (Imperial): 0402; Case Code (Metric): 1005; China RoHS: Compliant; Composition: Ceramic; Country of Origin: Mainland China, Taiwan; Depth: 500µm; Dielectric Material: Ceramic; Export Control Classification Number (ECCN) Code: EAR99; Halogen Free: Halogen Free; Height: 500µm; Harmonized Tariff Schedule (HTS) Code: 8532.24.00.20; Introduction Date: 2004-02-24; Lead Free: Lead Free; Length: 1mm; Lifecycle Status: Production; Material: Ceramic; Max Operating Temperature: 125°C; Min Operating Temperature: -55°C; Mounting Technology: Surface Mount; Pins: 2; Number of Terminals: 2; Packaging: Cut Tape (CT); Radiation Hardening: No; REACH SVHC: Yes; Schedule B: 8532240020, 8532240020|8532240020|8532240020|8532240020|8532240020|8532240020|8532240020|8532240020|8532240020|8532240020|8532240020|8532240020|8532240020|8532240020, 8532240020|8532240020|8532240020|8532240020|8532240020|8532240020|8532240020|8532240020|8532240020|8532240020|8532240020|8532240020|8532240020|8532240020|8532240020, 8532240020|8532240020|8532240020|8532240020|8532240020|8532240020|8532240020|8532240020|8532240020|8532240020|8532240020|8532240020|8532240020|8532240020|8532240020|8532240020; Termination: SMD/SMT; Thickness: 558.8µm; Voltage: 50V; Voltage Rating (DC): 50V; Width: 500µm; ComponentLink1URL: https://datasheet.octopart.com:443/CC0402KRX7R9BB103-Yageo-datasheet-177165144.pdf?src-supplier=IHS; ComponentLink1Description: https://datasheet.octopart.com:443/CC0402KRX7R9BB103-Yageo-datasheet-177165144.pdf?src-supplier=IHS; ComponentLink2URL: https://datasheet.octopart.com:443/CC0402KRX7R9BB103-Yageo-datasheet-10883670.pdf?src-supplier=Upverter; ComponentLink2Description: https://datasheet.octopart.com:443/CC0402KRX7R9BB103-Yageo-datasheet-10883670.pdf?src-supplier=Upverter; ComponentLink3URL: https://datasheet.octopart.com:443/CC0402KRX7R9BB103-Yageo-datasheet-82288757.pdf?src-supplier=Upverter; ComponentLink3Description: https://datasheet.octopart.com:443/CC0402KRX7R9BB103-Yageo-datasheet-82288757.pdf?src-supplier=Upverter; ComponentLink4URL: https://datasheet.octopart.com:443/CC0402KRX7R9BB103-Yageo-datasheet-78855684.pdf?src-supplier=Upverter; ComponentLink4Description: https://datasheet.octopart.com:443/CC0402KRX7R9BB103-Yageo-datasheet-78855684.pdf?src-supplier=Upverter; ComponentLink5URL: https://datasheet.octopart.com:443/CC0402KRX7R9BB103-Yageo-Group-datasheet-189192896.pdf?src-supplier=Future+Electronics; ComponentLink5Description: https://datasheet.octopart.com:443/CC0402KRX7R9BB103-Yageo-Group-datasheet-189192896.pdf?src-supplier=Future+Electronics; ComponentLink6URL: https://datasheet.octopart.com:443/CC0402KRX7R9BB103-Yageo-datasheet-166511530.pdf?src-supplier=Future+Electronics; ComponentLink6Description: https://datasheet.octopart.com:443/CC0402KRX7R9BB103-Yageo-datasheet-166511530.pdf?src-supplier=Future+Electronics; ComponentLink7URL: https://datasheet.octopart.com:443/CC0402KRX7R9BB103-Yageo-datasheet-137700082.pdf?src-supplier=Future+Electronics; ComponentLink7Description: https://datasheet.octopart.com:443/CC0402KRX7R9BB103-Yageo-datasheet-137700082.pdf?src-supplier=Future+Electronics; ComponentLink8URL: https://datasheet.octopart.com:443/CC0402KRX7R9BB103-Yageo-datasheet-137700084.pdf?src-supplier=Future+Electronics; ComponentLink8Description: https://datasheet.octopart.com:443/CC0402KRX7R9BB103-Yageo-datasheet-137700084.pdf?src-supplier=Future+Electronics; ComponentLink9URL: https://datasheet.octopart.com:443/CC0402KRX7R9BB103-Yageo-datasheet-27626582.pdf?src-supplier=Future+Electronics; ComponentLink9Description: https://datasheet.octopart.com:443/CC0402KRX7R9BB103-Yageo-datasheet-27626582.pdf?src-supplier=Future+Electronics; ComponentLink10URL: https://datasheet.octopart.com:443/CC0402KRX7R9BB103-Yageo-datasheet-15895757.pdf?src-supplier=Future+Electronics; ComponentLink10Description: https://datasheet.octopart.com:443/CC0402KRX7R9BB103-Yageo-datasheet-15895757.pdf?src-supplier=Future+Electronics; ComponentLink11URL: https://datasheet.octopart.com:443/CC0402KRX7R9BB103-Yageo-datasheet-12526321.pdf?src-supplier=Future+Electronics; ComponentLink11Description: https://datasheet.octopart.com:443/CC0402KRX7R9BB103-Yageo-datasheet-12526321.pdf?src-supplier=Future+Electronics; ComponentLink12URL: https://datasheet.octopart.com:443/CC0402KRX7R9BB103-Yageo-datasheet-8324192.pdf?src-supplier=Future+Electronics; ComponentLink12Description: https://datasheet.octopart.com:443/CC0402KRX7R9BB103-Yageo-datasheet-8324192.pdf?src-supplier=Future+Electronics; ComponentLink13URL: https://datasheet.octopart.com:443/CC0402KRX7R9BB103-Yageo-datasheet-147453679.pdf?src-supplier=Farnell; ComponentLink13Description: https://datasheet.octopart.com:443/CC0402KRX7R9BB103-Yageo-datasheet-147453679.pdf?src-supplier=Farnell; ComponentLink14URL: https://datasheet.octopart.com:443/CC0402KRX7R9BB103-Yageo-datasheet-181967450.pdf?src-supplier=Farnell; ComponentLink14Description: https://datasheet.octopart.com:443/CC0402KRX7R9BB103-Yageo-datasheet-181967450.pdf?src-supplier=Farnell; ComponentLink15URL: https://datasheet.octopart.com:443/CC0402KRX7R9BB103-Yageo-datasheet-140260305.pdf?src-supplier=element14+APAC; ComponentLink15Description: https://datasheet.octopart.com:443/CC0402KRX7R9BB103-Yageo-datasheet-140260305.pdf?src-supplier=element14+APAC; ComponentLink16URL: https://datasheet.octopart.com:443/CC0402KRX7R9BB103-Yageo-datasheet-178018856.pdf?src-supplier=Burklin+Elektronik; ComponentLink16Description: https://datasheet.octopart.com:443/CC0402KRX7R9BB103-Yageo-datasheet-178018856.pdf?src-supplier=Burklin+Elektronik; ComponentLink17URL: https://datasheet.octopart.com:443/CC0402KRX7R9BB103-Yageo-Group-datasheet-165992755.pdf?src-supplier=ODG+(Origin+Data+Global); ComponentLink17Description: https://datasheet.octopart.com:443/CC0402KRX7R9BB103-Yageo-Group-datasheet-165992755.pdf?src-supplier=ODG+(Origin+Data+Global); ComponentLink18URL: https://datasheet.octopart.com:443/CC0402KRX7R9BB103-Yageo-datasheet-151948686.pdf?src-supplier=TME; ComponentLink18Description: https://datasheet.octopart.com:443/CC0402KRX7R9BB103-Yageo-datasheet-151948686.pdf?src-supplier=TME; ComponentLink19URL: https://datasheet.octopart.com:443/CC0402KRX7R9BB103-Yageo-datasheet-120101875.pdf?src-supplier=Megastar; ComponentLink19Description: https://datasheet.octopart.com:443/CC0402KRX7R9BB103-Yageo-datasheet-120101875.pdf?src-supplier=Megastar; ComponentLink20URL: https://datasheet.octopart.com:443/CC0402KRX7R9BB103-Yageo-datasheet-8701427.pdf?src-supplier=element14; ComponentLink20Description: https://datasheet.octopart.com:443/CC0402KRX7R9BB103-Yageo-datasheet-8701427.pdf?src-supplier=element14; ComponentLink21URL: https://datasheet.octopart.com:443/CC0402KRX7R9BB103-Yageo-datasheet-499490.pdf?src-supplier=element14; ComponentLink21Description: https://datasheet.octopart.com:443/CC0402KRX7R9BB103-Yageo-datasheet-499490.pdf?src-supplier=element14; ComponentLink22URL: https://datasheet.octopart.com:443/CC0402KRX7R9BB103-Yageo-datasheet-5301394.pdf?src-supplier=element14; ComponentLink22Description: https://datasheet.octopart.com:443/CC0402KRX7R9BB103-Yageo-datasheet-5301394.pdf?src-supplier=element14; ComponentLink23URL: https://datasheet.octopart.com:443/CC0402KRX7R9BB103-Yageo-datasheet-62336348.pdf?src-supplier=Newark; ComponentLink23Description: https://datasheet.octopart.com:443/CC0402KRX7R9BB103-Yageo-datasheet-62336348.pdf?src-supplier=Newark; ComponentLink24URL: http://sigma.octopart.com:80/conflict_mineral_statement/Yageo-company-3.pdf?src-supplier=Compliance+Statements; ComponentLink24Description: http://sigma.octopart.com:80/conflict_mineral_statement/Yageo-company-3.pdf?src-supplier=Compliance+Statements; ComponentLink25URL: http://sigma.octopart.com:80/rohs_statement/Yageo-company-2.pdf?src-supplier=Compliance+Statements; ComponentLink25Description: http://sigma.octopart.com:80/rohs_statement/Yageo-company-2.pdf?src-supplier=Compliance+Statements